# Altium schematic sheet Snail-PCB-SCH_SH1_(01).SchDoc: SCHEMATIC, CCA,
size 863 x 558 mm; DocumentNumber: NIR-Spec-1; SheetNumber: 1; SheetTotal: 1
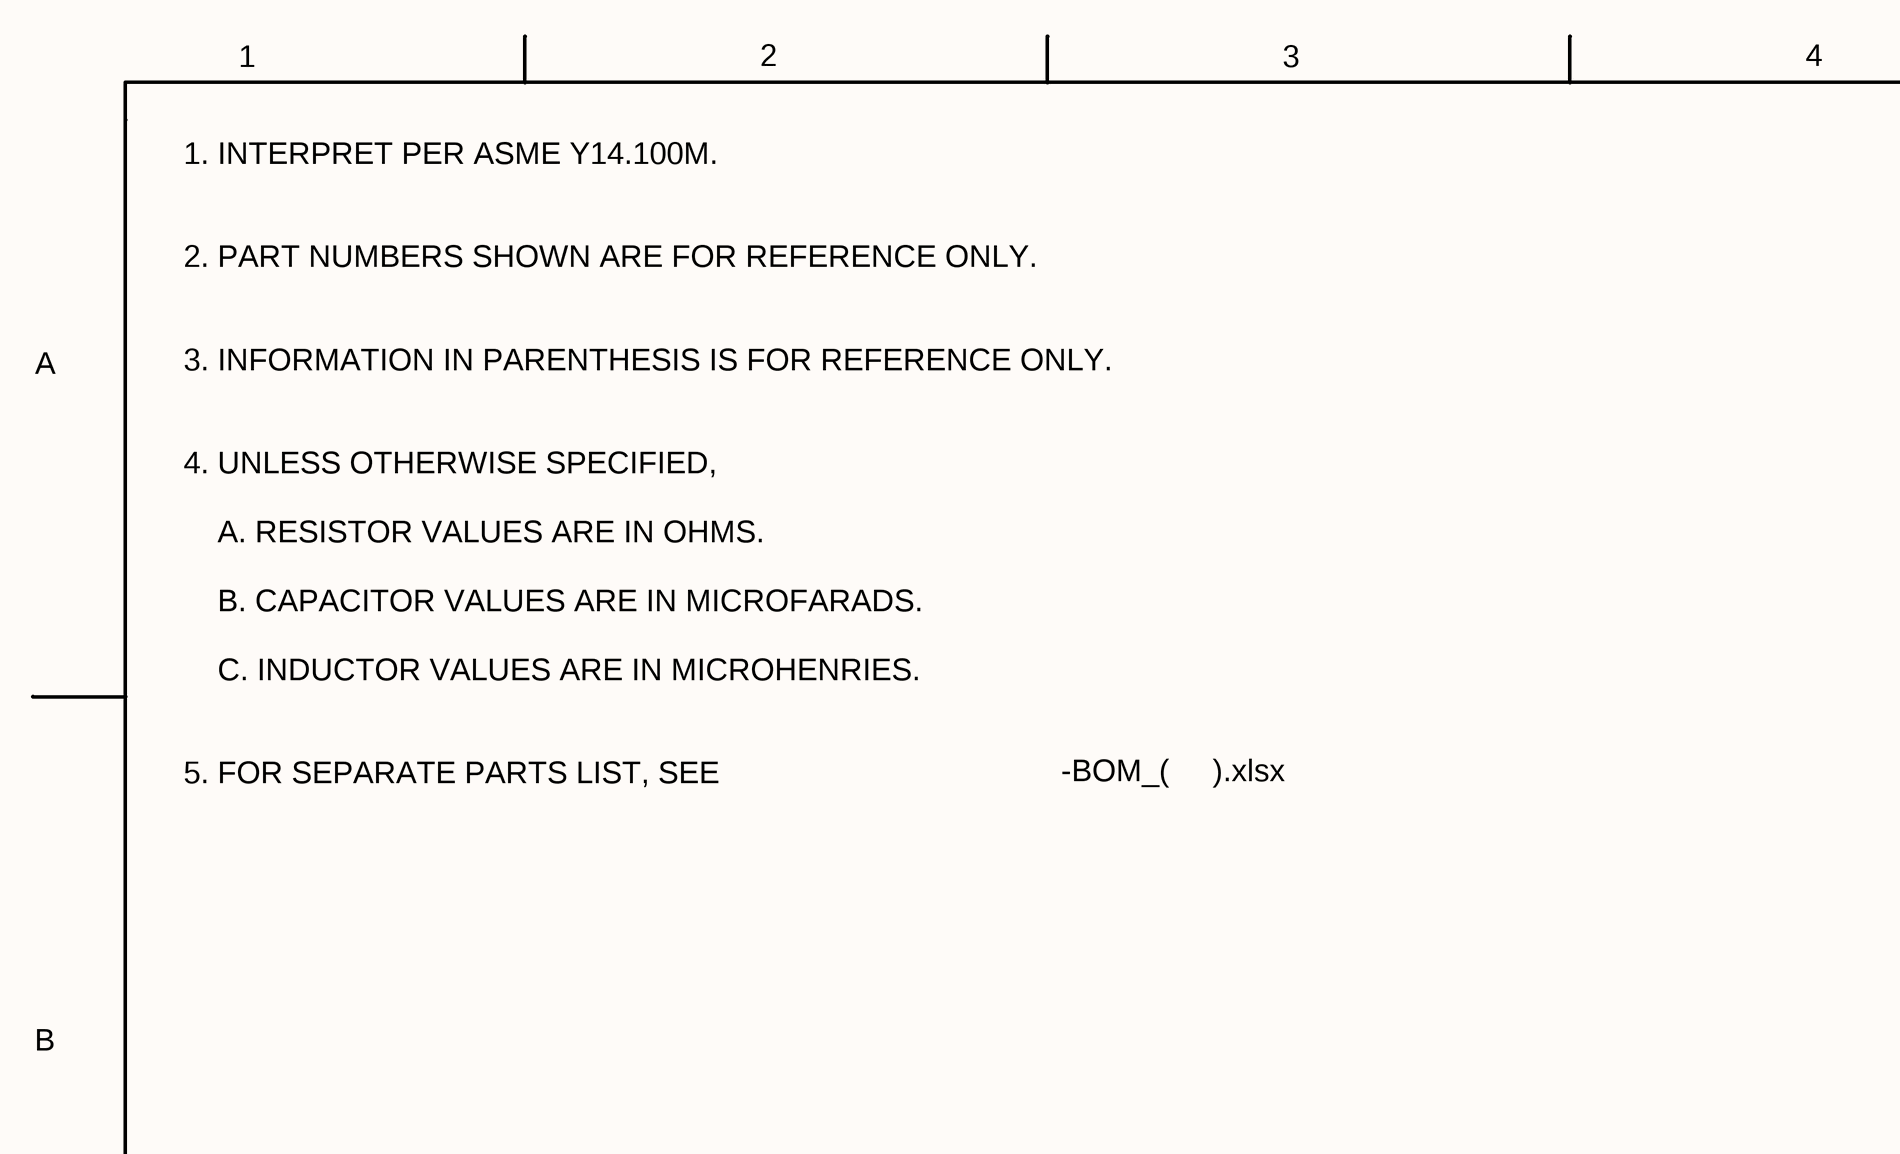
[diagram p0: Snail-PCB-SCH_SH1_(01).SchDoc, top left]
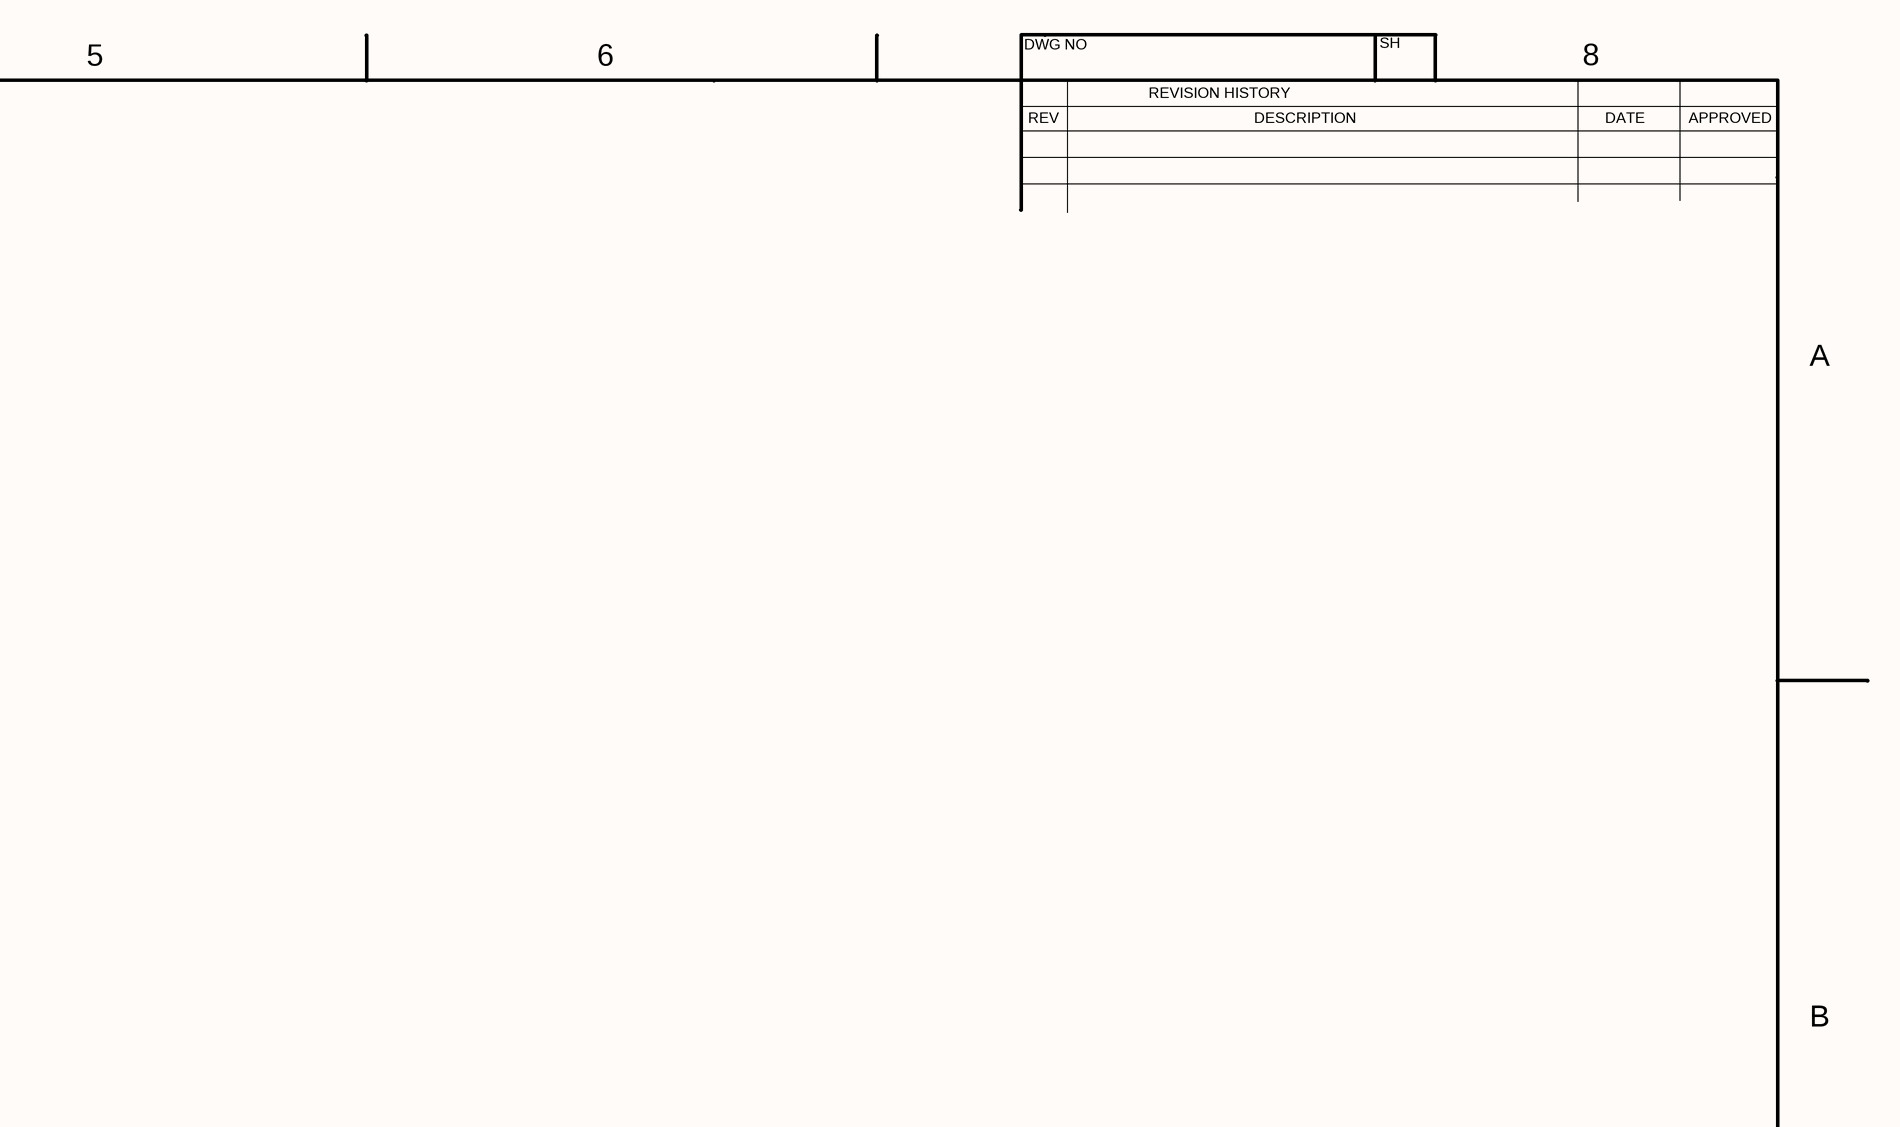
[diagram p1: Snail-PCB-SCH_SH1_(01).SchDoc, top right]
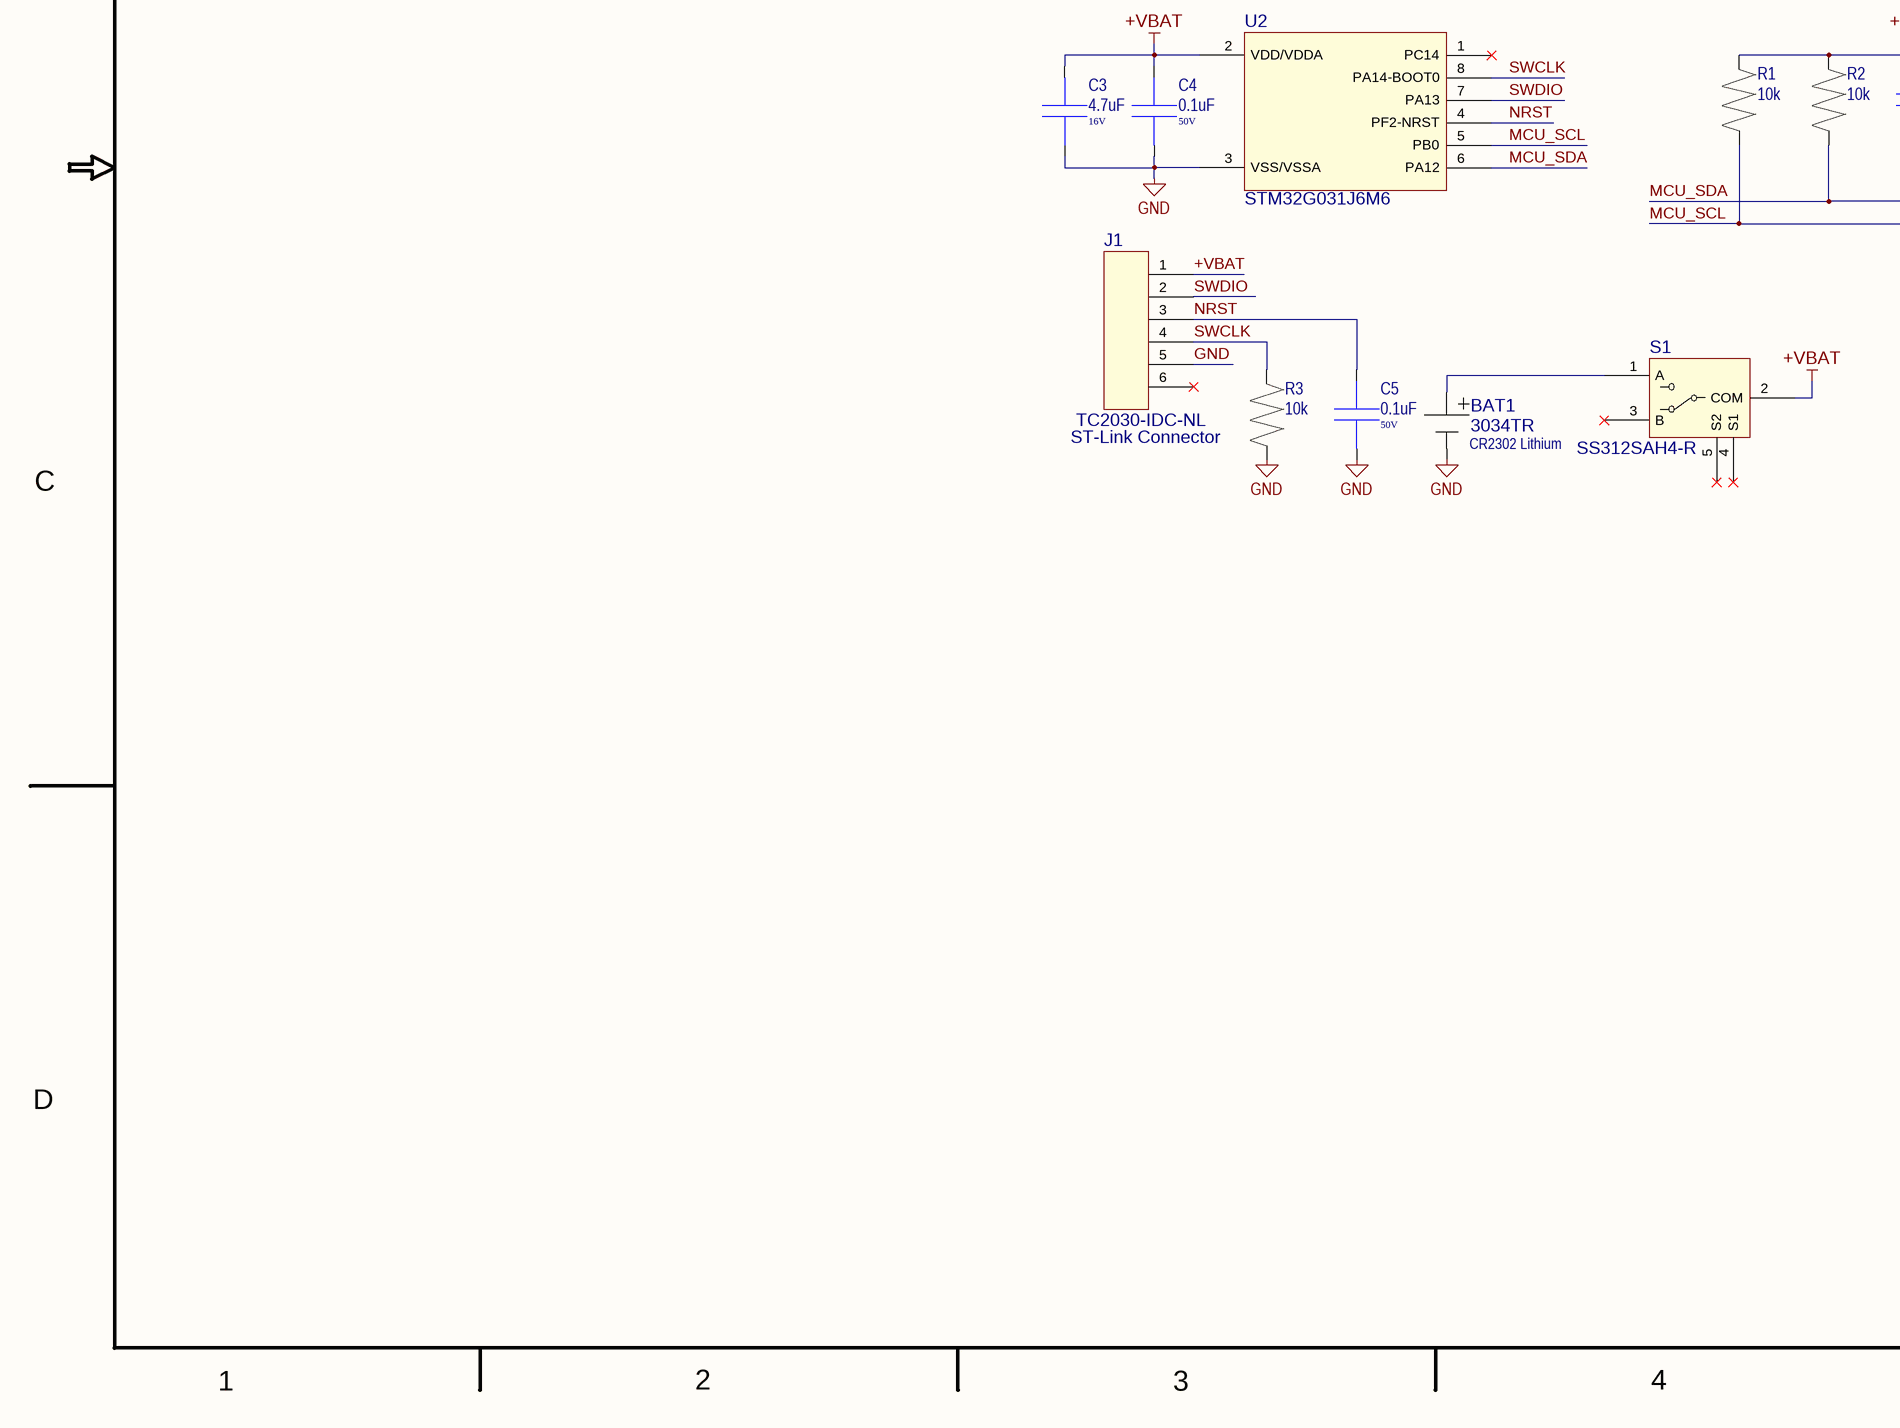
[diagram p2: Snail-PCB-SCH_SH1_(01).SchDoc, bottom left]
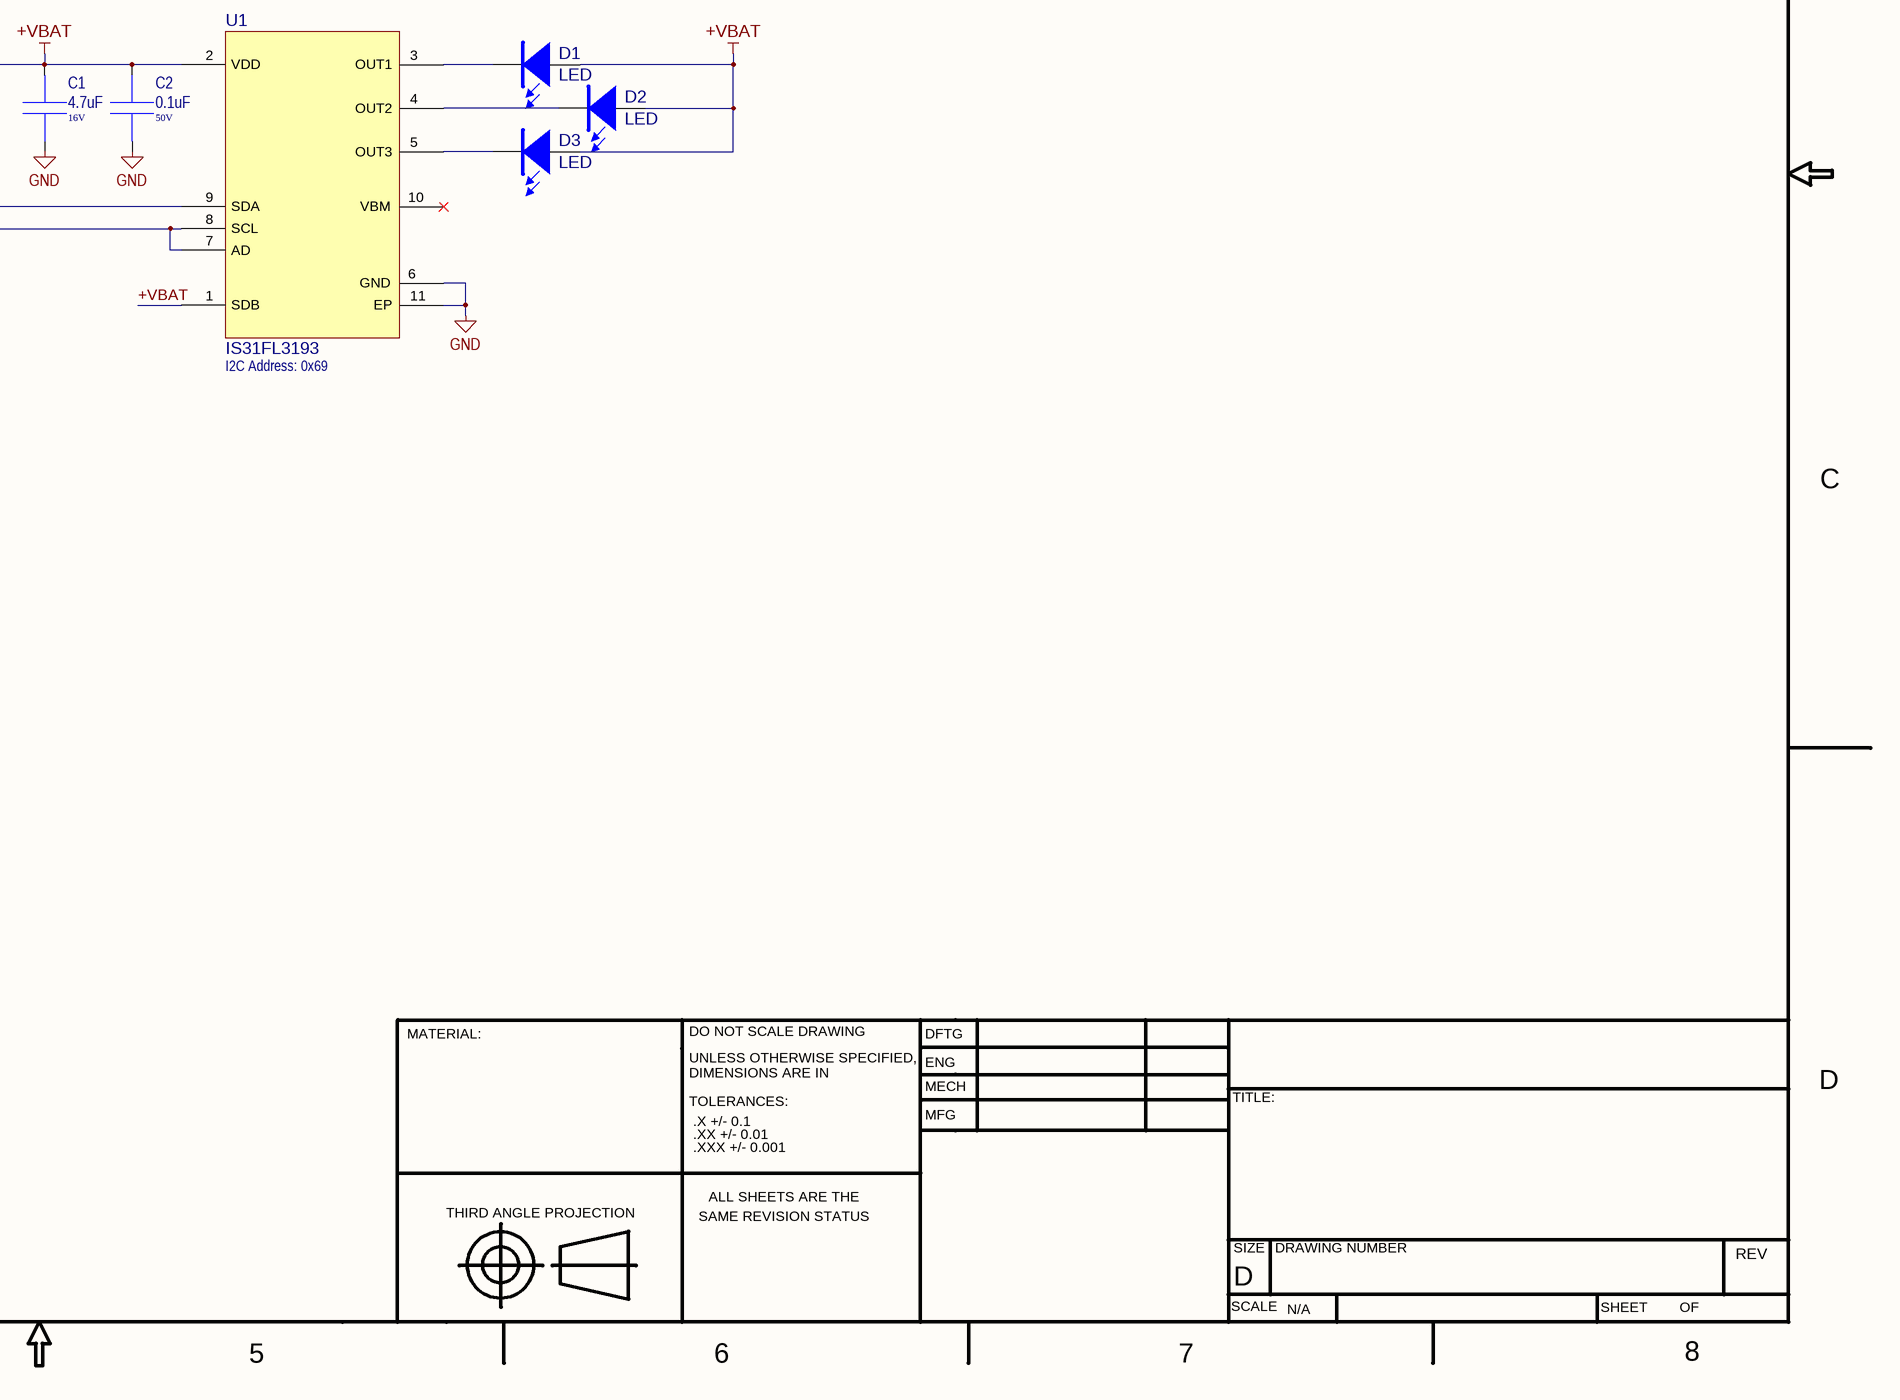
[diagram p3: Snail-PCB-SCH_SH1_(01).SchDoc, bottom right]

## Parts
BAT1  3034TR  [BAT_3034]
C1  4.7uF  Voltage: 16V  [0603]
C2  0.1uF  Voltage: 50V  [0603]
C3  4.7uF  Voltage: 16V  [0603]
C4  0.1uF  Voltage: 50V  [0603]
C5  0.1uF  Voltage: 50V  [0603]
D1  LED  [0603_LED_Red]
D2  LED  [0603_LED_Red]
D3  LED  [0603_LED_Red]
J1  TC2030-IDC-NL  [TC2030-IDC-NL-FP]  (no BOM)
R1  10k  [0603]
R2  10k  [0603]
R3  10k  [0603]
S1  SS312SAH4-R  [SW_SS312SAH4-R]
U1  IS31FL3193  [DFN-10]
U2  STM32G031J6M6  [SOIC-8]

## Nets
+VBAT: C1.1 C2.2 C3.1 C4.2 D1.1(A) D2.1(A) D3.1(A) J1.1 R1.1 R2.1 S1.2(COM) U1.1(SDB) U1.2(VDD) U2.2(VDD/VDDA)
GND: BAT1.2 C1.2 C2.1 C3.2 C4.1 C5.1 J1.5 R3.2 U1.6(GND) U1.11(EP) U2.3(VSS/VSSA)
MCU_SCL: R1.2 U1.7(AD) U1.8(SCL) U2.5(PB0)
MCU_SDA: R2.2 U1.9(SDA) U2.6(PA12)
NRST: C5.2 J1.3 U2.4(PF2-NRST)
SWCLK: J1.4 R3.1 U2.8(PA14-BOOT0)
SWDIO: J1.2 U2.7(PA13)
NetBAT1_1: BAT1.1 S1.1(A)
NetD1_2: D1.2(K) U1.3(OUT1)
NetD2_2: D2.2(K) U1.4(OUT2)
NetD3_2: D3.2(K) U1.5(OUT3)

Not connected (* = marked no-connect by the designer): J1 6*; S1 3(B)* 4(S1)* 5(S2)*; U1 10(VBM)*; U2 1(PC14)*

## Notes on the sheet
- 1
- 2
- 3
- 4
- 5
- 6
- DWG NO
- REVISION HISTORY
- SH
- 8
- REV
- DESCRIPTION
- DATE
- APPROVED
- A
- -BOM_(
- ).xlsx
- 1. INTERPRET PER ASME Y14.100M.
  2. PART NUMBERS SHOWN ARE FOR REFERENCE ONLY.
  3. INFORMATION IN PARENTHESIS IS FOR REFERENCE ONLY.
  4. UNLESS OTHERWISE SPECIFIED,
  A. RESISTOR VALUES ARE IN OHMS.
  B. CAPACITOR VALUES ARE IN MICROFARADS.
  C. INDUCTOR VALUES ARE IN MICROHENRIES.
  5. FOR SEPARATE PARTS LIST, SEE
- B
- I2C Address: 0x69
- ST-Link Connector
- (near BAT1) CR2302 Lithium
- C
- MATERIAL:
- DO NOT SCALE DRAWING
- UNLESS OTHERWISE SPECIFIED,
- ENG
- DFTG
- D
- DIMENSIONS ARE IN
- TOLERANCES:
- MECH
- MFG
- TITLE:
- .X +/- 0.1
- .XX +/- 0.01
- .XXX +/- 0.001
- THIRD ANGLE PROJECTION
- SAME REVISION STATUS
- ALL SHEETS ARE THE
- SIZE
- DRAWING NUMBER
- SCALE
- N/A
- SHEET        OF
- 7

## Library data of the parts
BAT1 = 3034: BATT RETAINER COIN 20MM 1CEL SMD; Manufacturer: Keystone Electronics; Part Number: 3034TR
C1 C3 = CAP: CAP CER 4.7UF 16V X5R 0603; Part Number: CL10A475KO8NNNC; Manufacturer: Samsung Electro-Mechanics; ClassName: -
C2 C4 C5 = CAP: CAP CER 0.1UF 50V X7R 0603; Part Number: CL10B104KB8NFNC; Manufacturer: Samsung Electro-Mechanics; ClassName: -
D1-D3 = LED_Red: LED HE RD 0603; Part Number: SM0603HCL; Manufacturer: Bivar; ClassName: -
J1 = TC2030-IDC-NL: CBL PLUG-OF-NAILS 6-PIN; Manufacturer: Tag-Connect LLC; Part Number: TC2030-IDC-NL
R1-R3 = RES: RES SMD 10K OHM 1% 1/5W 0603; Part Number: CR0603-FX-1002ELF; Manufacturer: Bourns; ClassName: -
S1 = SS312SAH4-R: SWITCH SLIDE SPDT 0.4VA 28V; Manufacturer: NKK Switches; Part Number: SS312SAH4-R
U1 = IS31FL3193: IC LED DRIVER LINEAR 42MA 10DFN; Manufacturer: Lumissil Microsystems; Part Number: IS31FL3193-DLS2-TR
U2 = STM32G031J6M6: IC MCU 32BIT 32KB FLASH 8SO; Manufacturer: STMicroelectronics; Part Number: STM32G031J6M6